# Altium schematic sheet Driver.SchDoc
size 259 x 167 mm; SheetNumber: 1; SheetTotal: 7
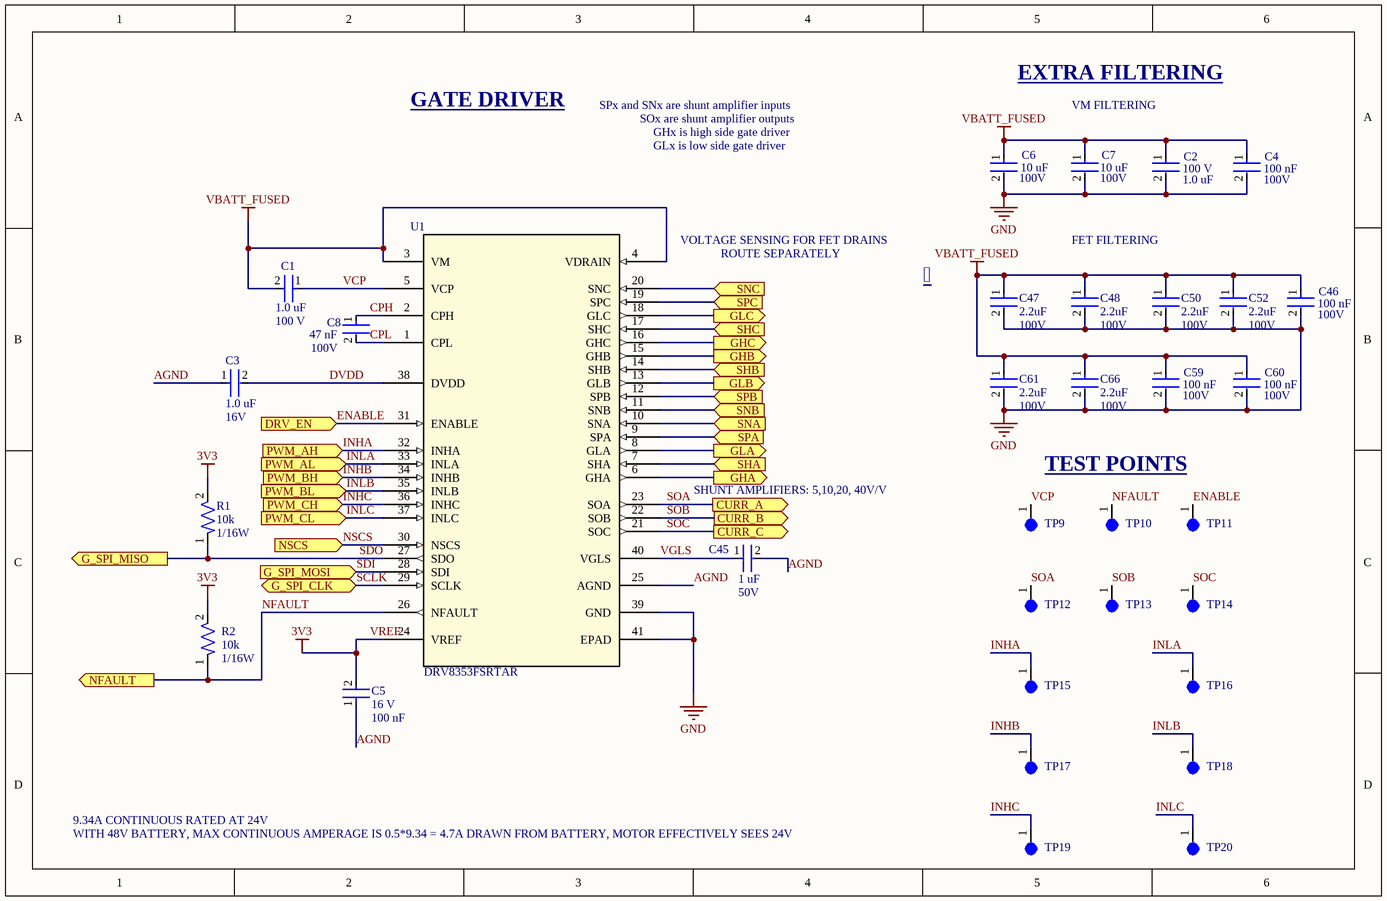
[diagram p0: Driver.SchDoc]

## Parts
C1  Voltage: 100 V  Capacitance: 1.0 uF  [CAP-0805]  (hidden comment: 08051C105K4Z2A)
C2  Voltage: 100 V  Capacitance: 1.0 uF  [CAP-0805]  (hidden comment: 08051C105K4Z2A)
C3  Capacitance: 1.0 uF  Voltage: 16V  [CAP-0603]  (hidden comment: CC0603KRX7R7BB105)
C4  Capacitance: 100 nF  Voltage: 100V  [CAP-0603]  (hidden comment: GRM188R72A104KA35D)
C5  Voltage Rating: 16 V  Capacitance: 100 nF  [CAP-0402]  (hidden comment: CC0402KRX7R7BB104)
C6  Capcitance: 10 uF  Voltage Rating: 100V  [CAP-1210]  (hidden comment: GRM32EC72A106KE05L)
C7  Capcitance: 10 uF  Voltage Rating: 100V  [CAP-1210]  (hidden comment: GRM32EC72A106KE05L)
C8  Capacitance: 47 nF  Voltage: 100V  [CAP-0603]  (hidden comment: C0603C473K1RACTU)
C45  Capacitance: 1 uF  Voltage: 50V  [CAP-0603]  (hidden comment: UMK107AB7105KA-T)
C46  Capacitance: 100 nF  Voltage: 100V  [CAP-0603]  (hidden comment: GRM188R72A104KA35D)
C47  Capacitance: 2.2uF  Voltage: 100V  [CAP-1206]  (hidden comment: CC1206KKX7R0BB225)
C48  Capacitance: 2.2uF  Voltage: 100V  [CAP-1206]  (hidden comment: CC1206KKX7R0BB225)
C50  Capacitance: 2.2uF  Voltage: 100V  [CAP-1206]  (hidden comment: CC1206KKX7R0BB225)
C52  Capacitance: 2.2uF  Voltage: 100V  [CAP-1206]  (hidden comment: CC1206KKX7R0BB225)
C59  Capacitance: 100 nF  Voltage: 100V  [CAP-0603]  (hidden comment: GRM188R72A104KA35D)
C60  Capacitance: 100 nF  Voltage: 100V  [CAP-0603]  (hidden comment: GRM188R72A104KA35D)
C61  Capacitance: 2.2uF  Voltage: 100V  [CAP-1206]  (hidden comment: CC1206KKX7R0BB225)
C66  Capacitance: 2.2uF  Voltage: 100V  [CAP-1206]  (hidden comment: CC1206KKX7R0BB225)
R1  Resistance: 10k  Power: 1/16W  [RES-0402]  (hidden comment: RC0402FR-0710KL)
R2  Resistance: 10k  Power: 1/16W  [RES-0402]  (hidden comment: RC0402FR-0710KL)
TP9  5003  [TEST-POINT-0001]  (value not drawn)
TP10  5003  [TEST-POINT-0001]  (value not drawn)
TP11  5003  [TEST-POINT-0001]  (value not drawn)
TP12  5003  [TEST-POINT-0001]  (value not drawn)
TP13  5003  [TEST-POINT-0001]  (value not drawn)
TP14  5003  [TEST-POINT-0001]  (value not drawn)
TP15  5003  [TEST-POINT-0001]  (value not drawn)
TP16  5003  [TEST-POINT-0001]  (value not drawn)
TP17  5003  [TEST-POINT-0001]  (value not drawn)
TP18  5003  [TEST-POINT-0001]  (value not drawn)
TP19  5003  [TEST-POINT-0001]  (value not drawn)
TP20  5003  [TEST-POINT-0001]  (value not drawn)
U1  DRV8353FSRTAR  [IC-GDRV-0002]

## Ports
CURR_A (out, see MCU[1C]), CURR_B (out, see MCU[1C]), CURR_C (out, see MCU[1C]), DRV_EN (in, see MCU[4B]), G_SPI_CLK (bidir, see MCU[1B]), G_SPI_MISO (out, see MCU[1B]), G_SPI_MOSI (in, see MCU[1B]), GHA (out, see FETs[2A]), GHB (out, see FETs[4A]), GHC (out, see FETs[5A]), GLA (out, see FETs[2C]), GLB (out, see FETs[4C]), GLC (out, see FETs[5C]), NFAULT (out, see MCU[1C]), NSCS (in, see MCU[4B]), PWM_AH (in, see MCU[1B]), PWM_AL (in, see MCU[1B]), PWM_BH (in, see MCU[1D]), PWM_BL (in, see MCU[1D]), PWM_CH (in, see MCU[1D]), PWM_CL (in, see MCU[1D]), SHA (in, see Connectors[4B], FETs[1B]), SHB (in, see Connectors[4B], FETs[3B]), SHC (in, see Connectors[4B], FETs[4B]), SNA (in, see FETs[1D]), SNB (in, see FETs[2D]), SNC (in, see FETs[4D]), SPA (in, see FETs[1C]), SPB (in, see FETs[2C]), SPC (in, see FETs[4C])

## Nets
GND: C2.2 C4.2 C6.2 C7.2 C46.2 C47.2 C48.2 C50.2 C52.2 C59.2 C60.2 C61.2 C66.2 U1.39(GND) U1.41(EPAD)
VBATT_FUSED: C1.2 C2.1 C4.1 C6.1 C7.1 C46.1 C47.1 C48.1 C50.1 C52.1 C59.1 C60.1 C61.1 C66.1 U1.3(VM) U1.4(VDRAIN)
VREF: C5.2 R1.2 R2.2 U1.24(VREF)  [also labelled 3V3]
AGND: C3.1 C5.1 C45.2 U1.25(AGND)
CPH: C8.1 U1.2(CPH)
CPL: C8.2 U1.1(CPL)
DVDD: C3.2 U1.38(DVDD)
ENABLE: TP11.1 U1.31(ENABLE) ; port DRV_EN
GHA: U1.6(GHA) ; port GHA
GHB: U1.15(GHB) ; port GHB
GHC: U1.16(GHC) ; port GHC
GLA: U1.8(GLA) ; port GLA
GLB: U1.13(GLB) ; port GLB
GLC: U1.18(GLC) ; port GLC
INHA: TP15.1 U1.32(INHA) ; port PWM_AH
INHB: TP17.1 U1.34(INHB) ; port PWM_BH
INHC: TP19.1 U1.36(INHC) ; port PWM_CH
INLA: TP16.1 U1.33(INLA) ; port PWM_AL
INLB: TP18.1 U1.35(INLB) ; port PWM_BL
INLC: TP20.1 U1.37(INLC) ; port PWM_CL
NFAULT: R2.1 TP10.1 U1.26(NFAULT) ; port NFAULT
NSCS: U1.30(NSCS) ; port NSCS
SCLK: U1.29(SCLK) ; port G_SPI_CLK
SDI: U1.28(SDI) ; port G_SPI_MOSI
SDO: R1.1 U1.27(SDO) ; port G_SPI_MISO
SHA: U1.7(SHA) ; port SHA
SHB: U1.14(SHB) ; port SHB
SHC: U1.17(SHC) ; port SHC
SNA: U1.10(SNA) ; port SNA
SNB: U1.11(SNB) ; port SNB
SNC: U1.20(SNC) ; port SNC
SOA: TP12.1 U1.23(SOA) ; port CURR_A
SOB: TP13.1 U1.22(SOB) ; port CURR_B
SOC: TP14.1 U1.21(SOC) ; port CURR_C
SPA: U1.9(SPA) ; port SPA
SPB: U1.12(SPB) ; port SPB
SPC: U1.19(SPC) ; port SPC
VCP: C1.1 TP9.1 U1.5(VCP)
VGLS: C45.1 U1.40(VGLS)

## Notes on the sheet
- GATE DRIVER
- SPx and SNx are shunt amplifier inputs
- EXTRA FILTERING
- VM FILTERING
- SOx are shunt amplifier outputs
- GHx is high side gate driver
- GLx is low side gate driver
- VOLTAGE SENSING FOR FET DRAINS
- FET FILTERING
- ROUTE SEPARATELY
- 
- SHUNT AMPLIFIERS: 5,10,20, 40V/V
- TEST POINTS
- 9.34A CONTINUOUS RATED AT 24V
- WITH 48V BATTERY, MAX CONTINUOUS AMPERAGE IS 0.5*9.34 = 4.7A DRAWN FROM BATTERY, MOTOR EFFECTIVELY SEES 24V

## Library data of the parts
C1 C2 = CAP-1U-0001: CAP CER 1UF 50V X7R 0805; ComponentLink2URL: https://www.yageo.com/upload/media/product/productsearch/datasheet/mlcc/UPY-GPHC_X7R_6.3V-to-250V_24.pdf; ComponentLink2Description: Datasheet; Device Class: Ceramic; Size: 0805
C3 = CAP-1U-0002: CAP CER 1UF 16V X7R 0603; Device Class: Ceramic; Size: 0603
C4 C46 C59 C60 = CAP-1U-0002: CAP CER 100NF 100V X7R 0603; Device Class: Ceramic; Size: 0603
C5 = CAP-0.1U-0001: CAP CER 0.1UF 16V X7R 0402; ComponentLink2Description: Datasheet; ComponentLink2URL: https://www.yageo.com/upload/media/product/productsearch/datasheet/mlcc/UPY-GPHC_X7R_6.3V-to-250V_24.pdf; Device Class: Ceramic; Size: 0402
C6 C7 = CAP-10U-0003: 10 µF ±10% 100V Ceramic Capacitor X7S 1210 (3225 Metric); Package Size: 1210
C8 = CAP-4.7U-0001: CAP CER 47NF 100V X5R 0603; Device Class: Ceramic; Size: 0603
C45 = CAP-1U-0002: 1 µF ±10% 50V Ceramic Capacitor X7R 0603 (1608 Metric); Package Size: 0603
C47 C48 C50 C52 C61 C66 = CAP-2.2U-0001: CAP CER 2.2UF 100V X7R 1206; Device Class: Ceramic; Size: 1206; ComponentLink1Description: Datasheet; ComponentLink1URL: https://www.yageo.com/upload/media/product/productsearch/datasheet/mlcc/UPY-GPHC_X7R_6.3V-to-250V_24.pdf
R1 R2 = RES-10k-0001: RES 10K OHM 1% 1/16W 0402; Tolerance: 1%; Size: 0402; ComponentLink1Description: Datasheet; ComponentLink1URL: https://www.yageo.com/upload/media/product/products/datasheet/rchip/PYu-RC_Group_51_RoHS_L_12.pdf
TP9-TP20 = TEST-POINT-0001: Oranange PC Test Point, Miniature Phoisphor Bronze Silver Plating Through Hole Mounting Type
U1 = IC-GDRV-0002: 102-V MAX 3-PHASE FUNCTIONAL SAF; Manufacturer_Name: Texas Instruments; VCC-max: 102V; Type: Power Management; Copyright: Copyright (C) 2025 Ultra Librarian. All rights reserved.; Manufacturer_Part_Number: DRV8353FSRTAR; RefDes: RefDes